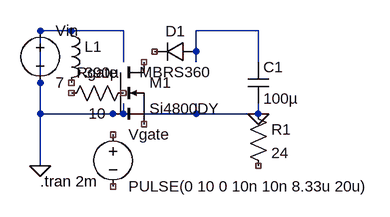
[diagram p0: schematic boost_variant6.asc]
boost_variant6.asc, the LTspice schematic file:
Version 4
SHEET 1 972 680
WIRE 96 128 96 128
WIRE 144 128 96 128
WIRE 224 128 144 128
WIRE 224 176 224 128
WIRE 96 256 96 128
WIRE 224 256 224 240
WIRE 224 256 96 256
WIRE 336 256 224 256
WIRE 432 128 336 128
WIRE 336 176 336 128
WIRE 336 256 336 240
WIRE 432 176 432 128
WIRE 432 256 432 240
WIRE 432 256 336 256
WIRE 96 336 96 256
FLAG 96 336 0
FLAG 432 256 0
SYMBOL voltage 96 112 R0
SYMATTR InstName Vin
SYMATTR Value 7
SYMBOL ind 128 112 R0
SYMATTR InstName L1
SYMATTR Value 390µ
SYMBOL nmos 208 176 R0
SYMATTR InstName M1
SYMATTR Value Si4800DY
SYMBOL diode 336 144 R90
WINDOW 0 0 32 VBottom 2
WINDOW 3 32 32 VTop 2
SYMATTR InstName D1
SYMATTR Value MBRS360
SYMBOL cap 416 176 R0
SYMATTR InstName C1
SYMATTR Value 100µ
SYMBOL res 416 240 R0
SYMATTR InstName R1
SYMATTR Value 24
SYMBOL voltage 208 272 R0
SYMATTR InstName Vgate
SYMATTR Value PULSE(0 10 0 10n 10n 8.33u 20u)
SYMBOL res 240 208 R90
WINDOW 0 0 56 VBottom 2
WINDOW 3 32 56 VTop 2
SYMATTR InstName Rgate
SYMATTR Value 10
TEXT 96 360 Left 2 !.tran 2m

The netlist it stands for:
* boost_variant6.asc
Vin 0 0 7
L1 0 NC_01 390µ
* M1: Si4800DY (symbol nmos not certain, pin order unknown); nets seen at it: 0
D1 N001 NC_04 MBRS360
C1 N001 0 100µ
R1 0 NC_05 24
Vgate NC_06 NC_07 PULSE(0 10 0 10n 10n 8.33u 20u)
Rgate NC_08 NC_09 10
.model D D
.lib standard.dio
.tran 2m
.backanno
.end